# Altium schematic sheet power.SchDoc
size A4
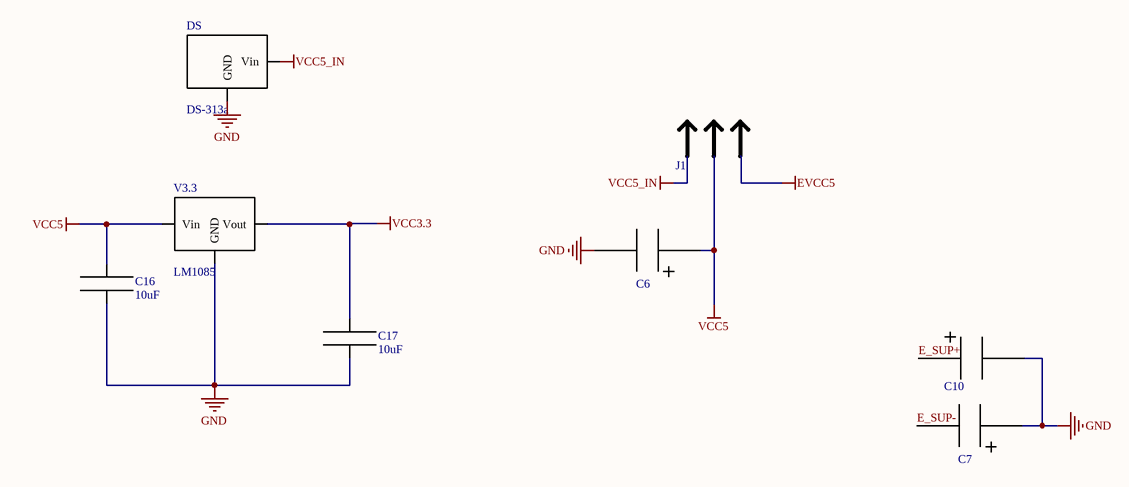
[diagram p0: power.SchDoc]

## Parts
C6  C_Ta  [C_Ta]  (value not drawn)
C7  C_Ta  [C_Ta]  (value not drawn)
C10  C_Ta  [C_Ta]  (value not drawn)
C16  10uF  [R0805]
C17  10uF  [R0805]
DS  DS-313a  [ds-313]
J1  JUMPER_SWITCH_2S  [JUMPER_SWITCH_2S]  (value not drawn)
V3.3  LM1085  [LM1085]

## Nets
EVCC5: J1.2
GND: C6.2 C7.1 C10.2 C16.2 C17.2 DS.0(GND) V3.3.0(GND)
VCC3.3: C17.1 V3.3.1(Vout)
VCC5: C6.1 C16.1 J1.0 V3.3.2(Vin)
VCC5_IN: DS.1(Vin) J1.1
E_SUP+: C10.1
E_SUP-: C7.2

## Library data of the parts
C6 C7 C10 = C_Ta: tantalum capacitor; capacity: *
C16 C17 = CAPACITY: Capacity: 10uF
J1 = JUMPER_SWITCH_2S: 2 state jumper switch